# EAGLE design MainBoard (EAGLE 7.3.0)
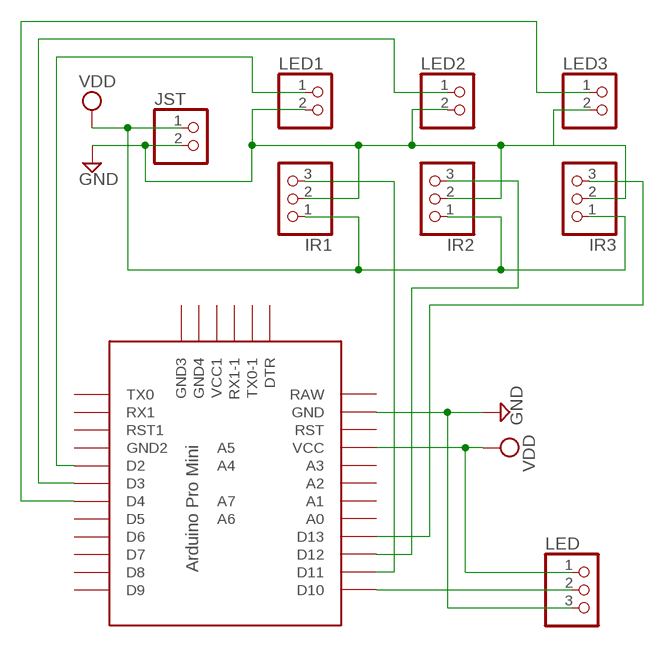
[diagram p0: schematic, sheet 1]

## Parts
IR1  PINHD-1X3  [1X03]
IR2  PINHD-1X3  [1X03]
IR3  PINHD-1X3  [1X03]
JST  PINHD-1X2/90  [1X02/90]
LED  PINHD-1X3  [1X03]
LED1  PINHD-1X2  [1X02]
LED2  PINHD-1X2  [1X02]
LED3  PINHD-1X2  [1X02]
U$1  PRO-MINI-2  [PRO-MINI-2]

## Nets
GND: IR1.2 IR2.2 IR3.2 JST.2 LED1.2 LED2.2 LED3.2 LED.3 U$1.GND
N$1: LED.2 U$1.D10
N$2: LED1.1 U$1.D2
N$3: LED2.1 U$1.D3
N$4: LED3.1 U$1.D4
N$5: IR1.3 U$1.D11
N$6: IR2.3 U$1.D12
N$7: IR3.3 U$1.D13
VDD: IR1.1 IR2.1 IR3.1 JST.1 LED.1 U$1.VCC
Unconnected: U$1.A0 U$1.A1 U$1.A2 U$1.A3 U$1.A4 U$1.A5 U$1.A6 U$1.A7 U$1.D5 U$1.D6 U$1.D7 U$1.D8 U$1.D9 U$1.DTR U$1.GND1(GND2) U$1.GND2(GND3) U$1.GND3(GND4) U$1.RAW U$1.RST U$1.RST1 U$1.RX1 U$1.RX1-1 U$1.TX0 U$1.TX0-1 U$1.VCC1

## Library data of the parts
IR1-IR3 LED = pinhead:PINHD-1X3: PIN HEADER
JST LED1-LED3 = pinhead:PINHD-1X2: PIN HEADER
U$1 = Arduino-clone:PRO-MINI-2: Arduino Pro Mini Layout 2 Sparkfun.com

## Board
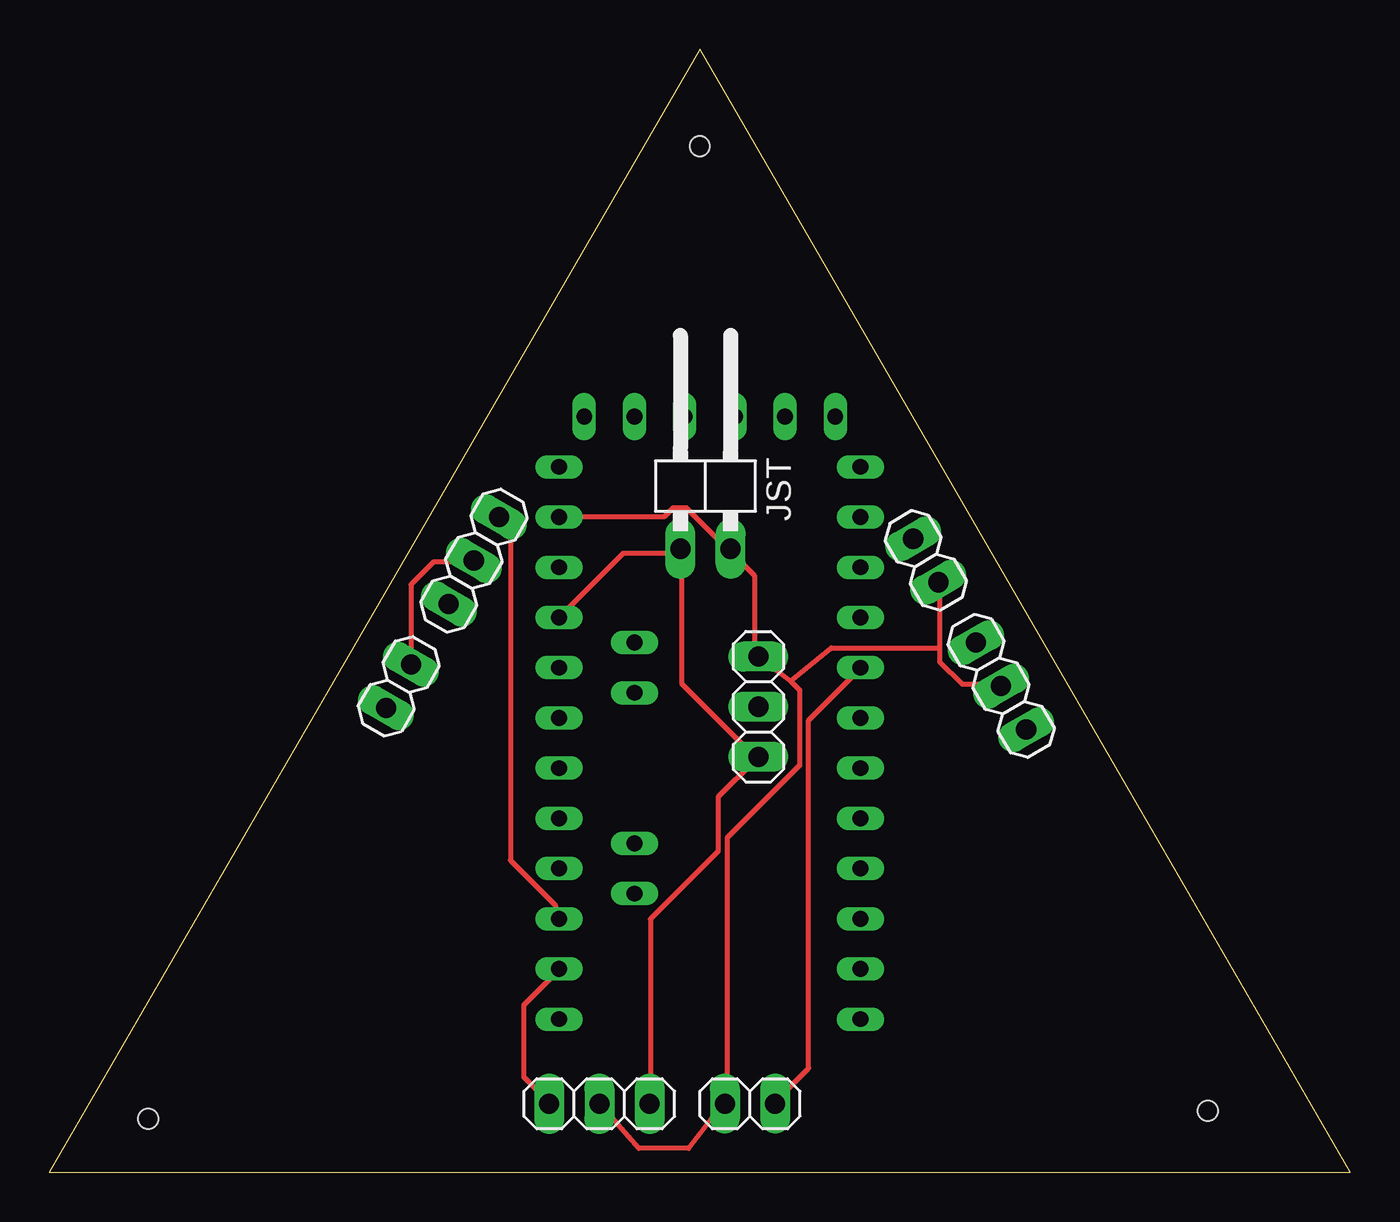
[diagram p1: board, top side]
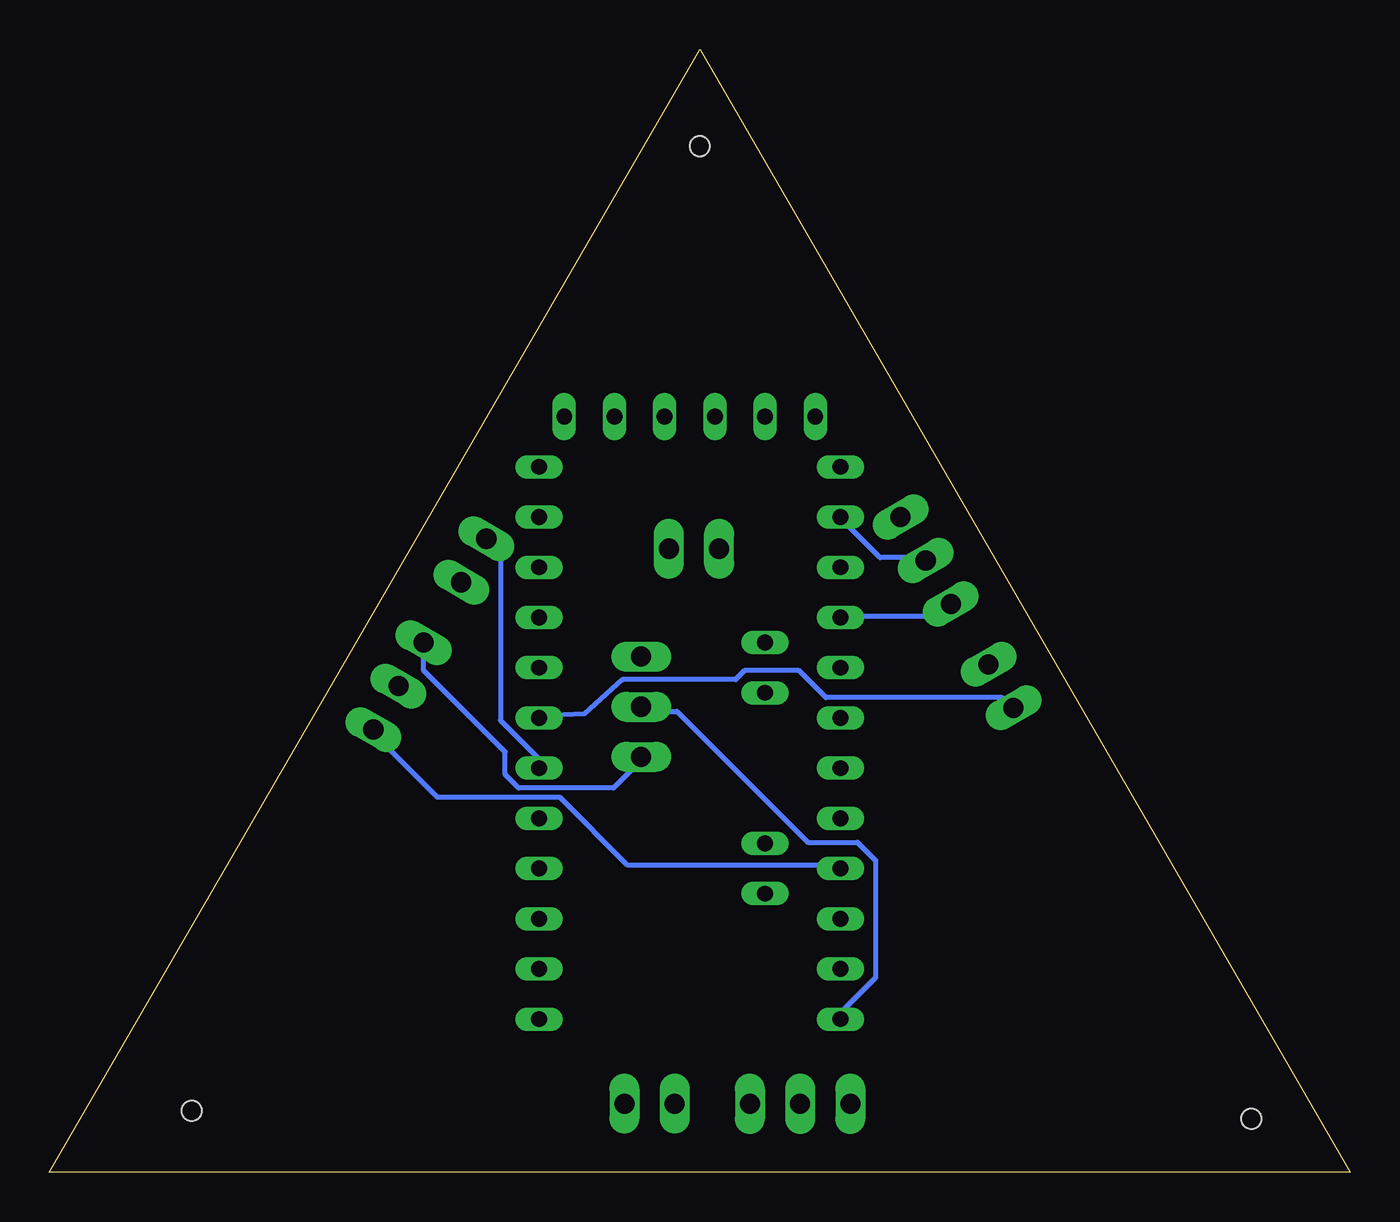
[diagram p2: board, bottom side, seen from below]

Size 65.8 x 56.8 mm. Coordinates in mm from the lower left corner, seen from the top.
Outline: 0,0 65.8,0 32.9,56.8 0,0
Copper layers (1*16): Top 0.035mm / dielectric 1.53mm / Bottom 0.035mm
Design rules "pban_5mil-l2": minimum track width 5mil, minimum drill 0.3mm, track to track 5mil, track to pad 0.229mm, pad to pad 5mil, via to via 5mil, smd to smd 5mil, copper to edge 0.5mm, drill to drill 0.5mm, minimum pad ring 0.15mm, minimum via ring 0.15mm, stop-mask expansion 4mil, vias tented up to drill 0.35mm, thermal gap 10mil
Holes 1 mm at 32.9,51.9 5,2.7 58.6,3.1

### Footprints (pad centres in the part's own frame; a part is rotated, then mirrored left to right if it is on the bottom)
1X03 = drill 1.016 long: 1 -2.54,0; 2 0,0; 3 2.54,0
1X02/90 = drill 1.016 long: 1 -1.27,-3.81; 2 1.27,-3.81
1X02 = drill 1.016 long: 1 -1.27,0; 2 1.27,0
PRO-MINI-2 = drill 0.8 long: A0 6.35,2.54; A1 6.35,0; A2 6.35,-2.54; A3 6.35,-5.08; A4 2.54,1.27; A5 2.54,3.81; A6 2.54,-8.89; A7 2.54,-6.35; D2 -8.89,2.54; D3 -8.89,0; D4 -8.89,-2.54; D5 -8.89,-5.08; D6 -8.89,-7.62; D7 -8.89,-10.16; D8 -8.89,-12.7; D9 -8.89,-15.24; D10 6.35,-15.24; D11 6.35,-12.7; D12 6.35,-10.16; D13 6.35,-7.62; DTR 5.08,15.24; GND 6.35,10.16; GND1 -8.89,5.08; GND2 -7.62,15.24; GND3 -5.08,15.24; RAW 6.35,12.7; RST 6.35,7.62; RST1 -8.89,7.62; RX1 -8.89,10.16; RX1-1 0,15.24; TX0 -8.89,12.7; TX0-1 2.54,15.24; VCC 6.35,5.08; VCC1 -2.54,15.24

### Placement (x,y rotation side)
IR1  27.82,3.46 180 top
IR2  21.47,30.94 60 top
IR3  48.14,24.59 300 top
JST  33.19,35.34 0 top
LED  35.87,23.55 90 top
LED1  35.44,3.46 180 top
LED2  17.66,24.59 60 top
LED3  44.33,30.94 300 top
U$1  32.13,22.98 0 bottom

### Tracks (layer width: path | path; a pad name or v marks a point on that pad's centre or on a via)
GND
  Top 0.254: LED2.2 18.29,25.83 18.29,29.72 19.43,30.86 21.26,30.86 IR2.2 | 45.03,26.52 45.03,29.72 LED3.2 | 45.03,26.52 45.03,25.83 46.18,24.69 48.01,24.69 IR3.2 | IR1.2 27.89,3.43 29.82,1.2 32.33,1.2 34.06,3.43 LED1.2 34.29,3.66 34.29,16.92 37.95,20.57 37.95,24.4 37.49,24.86 | 37.49,24.86 35.89,26.06 LED.3 35.66,26.29 35.66,30.18 34.52,31.32 JST.2 34.29,31.55 32.23,33.6 31.55,33.6 31.09,33.15 25.83,33.15 U$1.GND | 45.03,26.52 39.55,26.52 37.49,24.86
  Bottom 0.254: U$1.GND 25.6,32.92 23.77,31.09 21.49,31.09 IR2.2
N$1
  Bottom 0.254: U$1.D10 25.6,7.77 25.6,8.23 24,9.83 24,15.77 24.92,16.69 27.43,16.69 34.06,23.32 35.66,23.32 LED.2
N$2
  Top 0.254: U$1.D2 40.92,25.38 38.41,22.86 38.41,5.26 36.8,3.66 LED1.1
N$3
  Bottom 0.254: U$1.D3 40.92,23.09 38.73,23.19 36.8,24.92 31.09,24.92 30.63,25.38 27.89,25.38 26.52,24 17.6,24 17.14,23.55 LED2.1
N$4
  Bottom 0.254: U$1.D4 41.15,20.57 41.15,21.03 42.98,22.86 42.98,31.32 43.66,32 LED3.1
N$5
  Top 0.254: U$1.D11 25.6,10.06 24,8.46 24,4.8 25.15,3.66 IR1.3
N$6
  Top 0.254: U$1.D12 25.6,13.03 25.6,13.49 23.32,15.77 23.32,32.46 22.86,32.92 IR2.3
N$7
  Bottom 0.254: U$1.D13 25.83,15.54 36.58,15.54 40.01,18.97 46.18,18.97 49.38,22.17 IR3.3
VDD
  Top 0.254: U$1.VCC 25.83,28.12 29.03,31.32 31.77,31.32 JST.1 32,31.32 32,24.69 35.66,21.03 LED.1 35.66,20.8 33.83,18.97 33.83,16.23 30.4,12.8 30.4,3.66 IR1.1
  Bottom 0.254: U$1.VCC 25.6,28.12 20.8,28.12 20.34,28.57 IR2.1 | IR3.1 46.86,26.75 46.86,25.38 42.75,21.26 42.75,20.12 42.06,19.43 37.26,19.43 35.89,20.8 LED.1